# EAGLE schematic addon (EAGLE 7.6.0)
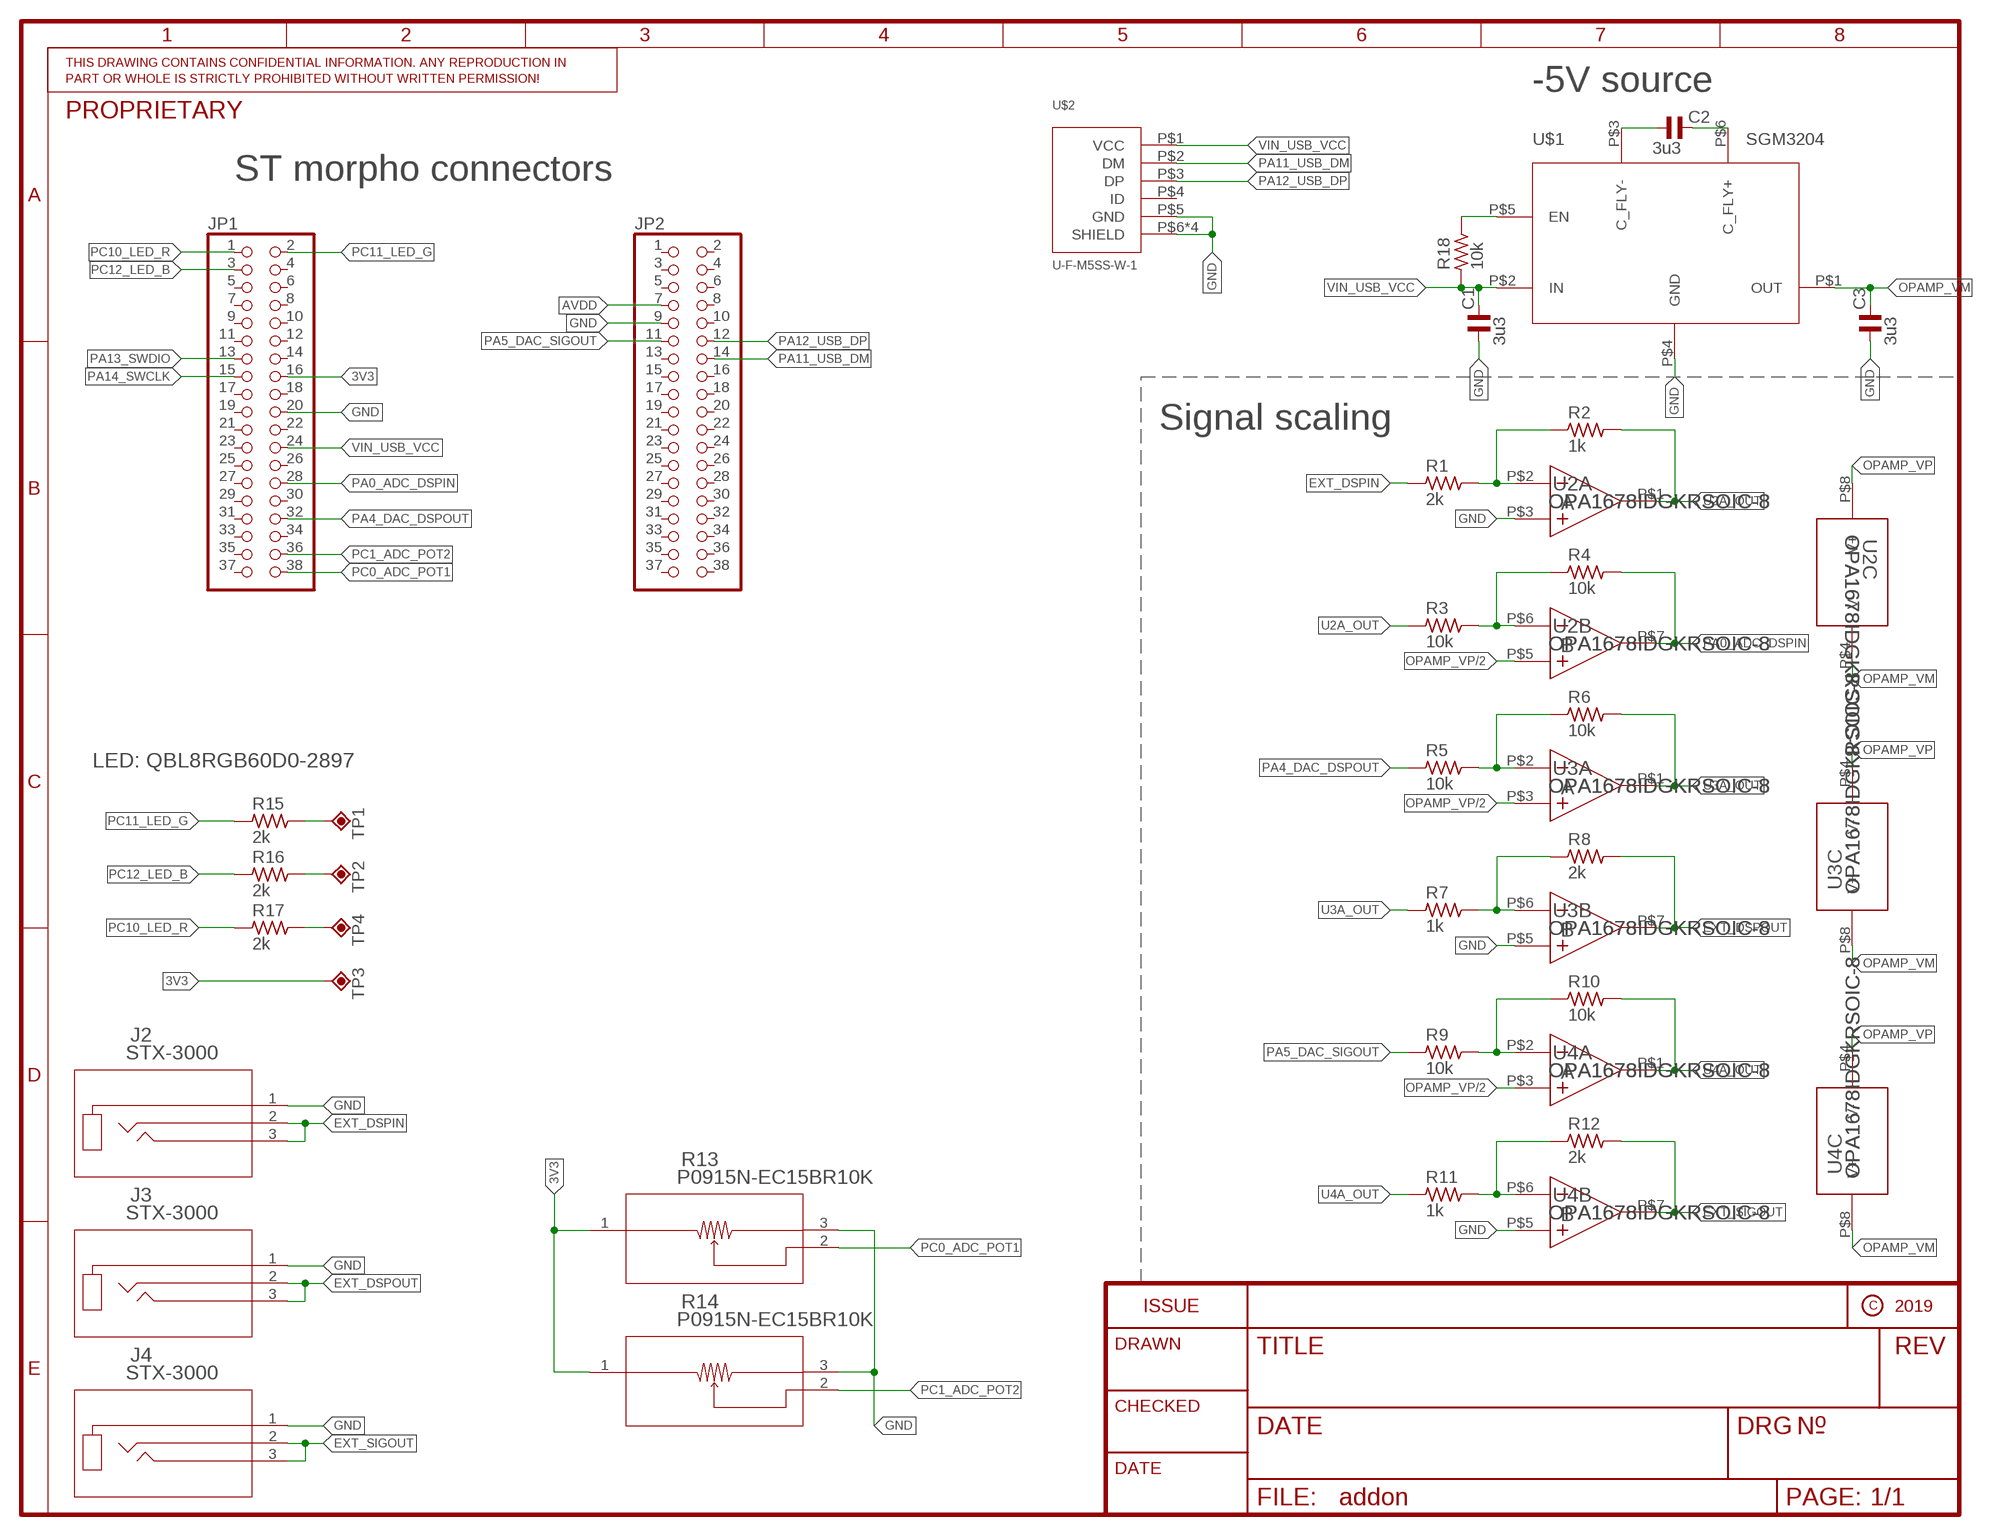
[diagram p0: schematic, sheet 1]

## Parts
C1  3u3  C_0603  [C0603]
C2  3u3  C_0603  [C0603]
C3  3u3  C_0603  [C0603]
J2  STX-3000  [STX-3000_KYC]
J3  STX-3000  [STX-3000_KYC]
J4  STX-3000  [STX-3000_KYC]
JP1  PINHD-2X19  [2X19]
JP2  PINHD-2X19  [2X19]
R1  2k  R_0603  [R0603]
R2  1k  R_0603  [R0603]
R3  10k  R_0603  [R0603]
R4  10k  R_0603  [R0603]
R5  10k  R_0603  [R0603]
R6  10k  R_0603  [R0603]
R7  1k  R_0603  [R0603]
R8  2k  R_0603  [R0603]
R9  10k  R_0603  [R0603]
R10  10k  R_0603  [R0603]
R11  1k  R_0603  [R0603]
R12  2k  R_0603  [R0603]
R13  P0915N-EC15BR10K  [P0915N-EC15BR10K_BIT]
R14  P0915N-EC15BR10K  [P0915N-EC15BR10K_BIT]
R15  2k  R_0603  [R0603]
R16  2k  R_0603  [R0603]
R17  2k  R_0603  [R0603]
R18  10k  R_0603  [R0603]
TP1  TPP-5000-M  [5000-M]
TP2  TPP-5000-M  [5000-M]
TP3  TPP-5000-M  [5000-M]
TP4  TPP-5000-M  [5000-M]
U2  OPA1678IDGKRSOIC-8  [SOIC-8]
U3  OPA1678IDGKRSOIC-8  [SOIC-8]
U4  OPA1678IDGKRSOIC-8  [SOIC-8]
U$1  SGM3204  [SOT-23-6]
U$2  U-F-M5SS-W-1  [MICRO-B-USB]

## Nets
3V3: JP1.16 R13.1 R14.1 TP3.1(P)
AVDD: JP2.7
EXT_DSPIN: J2.2 J2.3 R1.1
EXT_DSPOUT: J3.2 J3.3 R8.2 U3.P$7(B:OUT)
EXT_SIGOUT: J4.2 J4.3 R12.2 U4.P$7(B:OUT)
GND: C1.1 C3.1 J2.1 J3.1 J4.1 JP1.20 JP2.9 R13.3 R14.3 U2.P$3(A:IN+) U3.P$5(B:IN+) U4.P$5(B:IN+) U$1.P$4(GND) U$2.P$5(GND) U$2.P$6(SHIELD) U$2.P$7(SHIELD) U$2.P$8(SHIELD) U$2.P$9(SHIELD)
N$1: R15.2 TP1.1(P)
N$2: C2.1 U$1.P$3(C_FLY-)
N$3: C2.2 U$1.P$6(C_FLY+)
N$4: R1.2 R2.1 U2.P$2(A:IN-)
N$5: R5.2 R6.1 U3.P$2(A:IN-)
N$6: R16.2 TP2.1(P)
N$7: R17.2 TP4.1(P)
N$8: R3.2 R4.1 U2.P$6(B:IN-)
N$11: R7.2 R8.1 U3.P$6(B:IN-)
N$14: R18.2 U$1.P$5(EN)
N$17: R9.2 R10.1 U4.P$2(A:IN-)
N$18: R11.2 R12.1 U4.P$6(B:IN-)
OPAMP_VM: C3.2 U2.P$4(C:V-) U3.P$8(C:V+) U4.P$8(C:V+) U$1.P$1(OUT)
OPAMP_VP: U2.P$8(C:V+) U3.P$4(C:V-) U4.P$4(C:V-)
OPAMP_VP/2: U2.P$5(B:IN+) U3.P$3(A:IN+) U4.P$3(A:IN+)
PA0_ADC_DSPIN: JP1.28 R4.2 U2.P$7(B:OUT)
PA4_DAC_DSPOUT: JP1.32 R5.1
PA5_DAC_SIGOUT: JP2.11 R9.1
PA11_USB_DM: JP2.14 U$2.P$2(DM)
PA12_USB_DP: JP2.12 U$2.P$3(DP)
PA13_SWDIO: JP1.13
PA14_SWCLK: JP1.15
PC0_ADC_POT1: JP1.38 R13.2
PC1_ADC_POT2: JP1.36 R14.2
PC10_LED_R: JP1.1 R17.1
PC11_LED_G: JP1.2 R15.1
PC12_LED_B: JP1.3 R16.1
U2A_OUT: R2.2 R3.1 U2.P$1(A:OUT)
U3A_OUT: R6.2 R7.1 U3.P$1(A:OUT)
U4A_OUT: R10.2 R11.1 U4.P$1(A:OUT)
VIN_USB_VCC: C1.2 JP1.24 R18.1 U$1.P$2(IN) U$2.P$1(VCC)
Unconnected: JP1.4 JP1.5 JP1.6 JP1.7 JP1.8 JP1.9 JP1.10 JP1.11 JP1.12 JP1.14 JP1.17 JP1.18 JP1.19 JP1.21 JP1.22 JP1.23 JP1.25 JP1.26 JP1.27 JP1.29 JP1.30 JP1.31 JP1.33 JP1.34 JP1.35 JP1.37 JP2.1 JP2.2 JP2.3 JP2.4 JP2.5 JP2.6 JP2.8 JP2.10 JP2.13 JP2.15 JP2.16 JP2.17 JP2.18 JP2.19 JP2.20 JP2.21 JP2.22 JP2.23 JP2.24 JP2.25 JP2.26 JP2.27 JP2.28 JP2.29 JP2.30 JP2.31 JP2.32 JP2.33 JP2.34 JP2.35 JP2.36 JP2.37 JP2.38 U$2.P$4(ID)

## Notes on the sheet
- -5V source
- ST morpho connectors
- Signal scaling
- LED: QBL8RGB60D0-2897

## Library data of the parts
C1-C3 = rc-master-smd:C_: NON-POLARIZED CAP; PARTNO: CL10A335KP8NNNC
J2-J4 = parts:STX-3000; BUILT_BY: EMA_Cory; COPYRIGHT: Copyright (C) 2018 Accelerated Designs. All rights reserved; DATASHEET: http://www.kycon.com/Pub_Eng_Draw/STX-3000.pdf; MANUFACTURER_PART_NUMBER: STX-3000; PARTNO: STX-3000; SOURCELIBRARY: Kycon_2020-02-25; VENDOR: Kycon Cable & Connector
JP1 JP2 = pinhead:PINHD-2X19: PIN HEADER
R1-R12 R15-R17 = rc-master:R_: RESISTOR
R13 R14 = parts:P0915N-EC15BR10K; BUILT_BY: EMA_Cory; COPYRIGHT: Copyright (C) 2018 Accelerated Designs. All rights reserved; DATASHEET: https://www.ttelectronics.com/TTElectronics/media/ProductFiles/Potentiometers/Datasheets/P09x.pdf; MANUFACTURER_PART_NUMBER: P0915N-EC15BR10K; PARTNO: P0915N-EC15BR10K; SOURCELIBRARY: Bi_Technologies_2020-05-20; VENDOR: BI Technologies
R18 = rc-master-smd:R_: RESISTOR
TP1-TP4 = testpoint:TPP: TEST POINT PAD
U2-U4 = parts:OPA1678IDGKR; PARTNO: NE5532DR
U$1 = parts:SGM3204; PARTNO: SGM3204YN6G/TR
U$2 = parts:U-F-M5SS-W-1; PARTNO: U-F-M5SS-W-1